# EasyEDA schematic SCH_Line-Follower-Circuit_2025-12-18.json
TITLE: Sheet_1; REV: 1.0; Date: 2025-11-16; Sheet: 1/1; Drawn By: Bhanusivaprakash; Company: Your Company
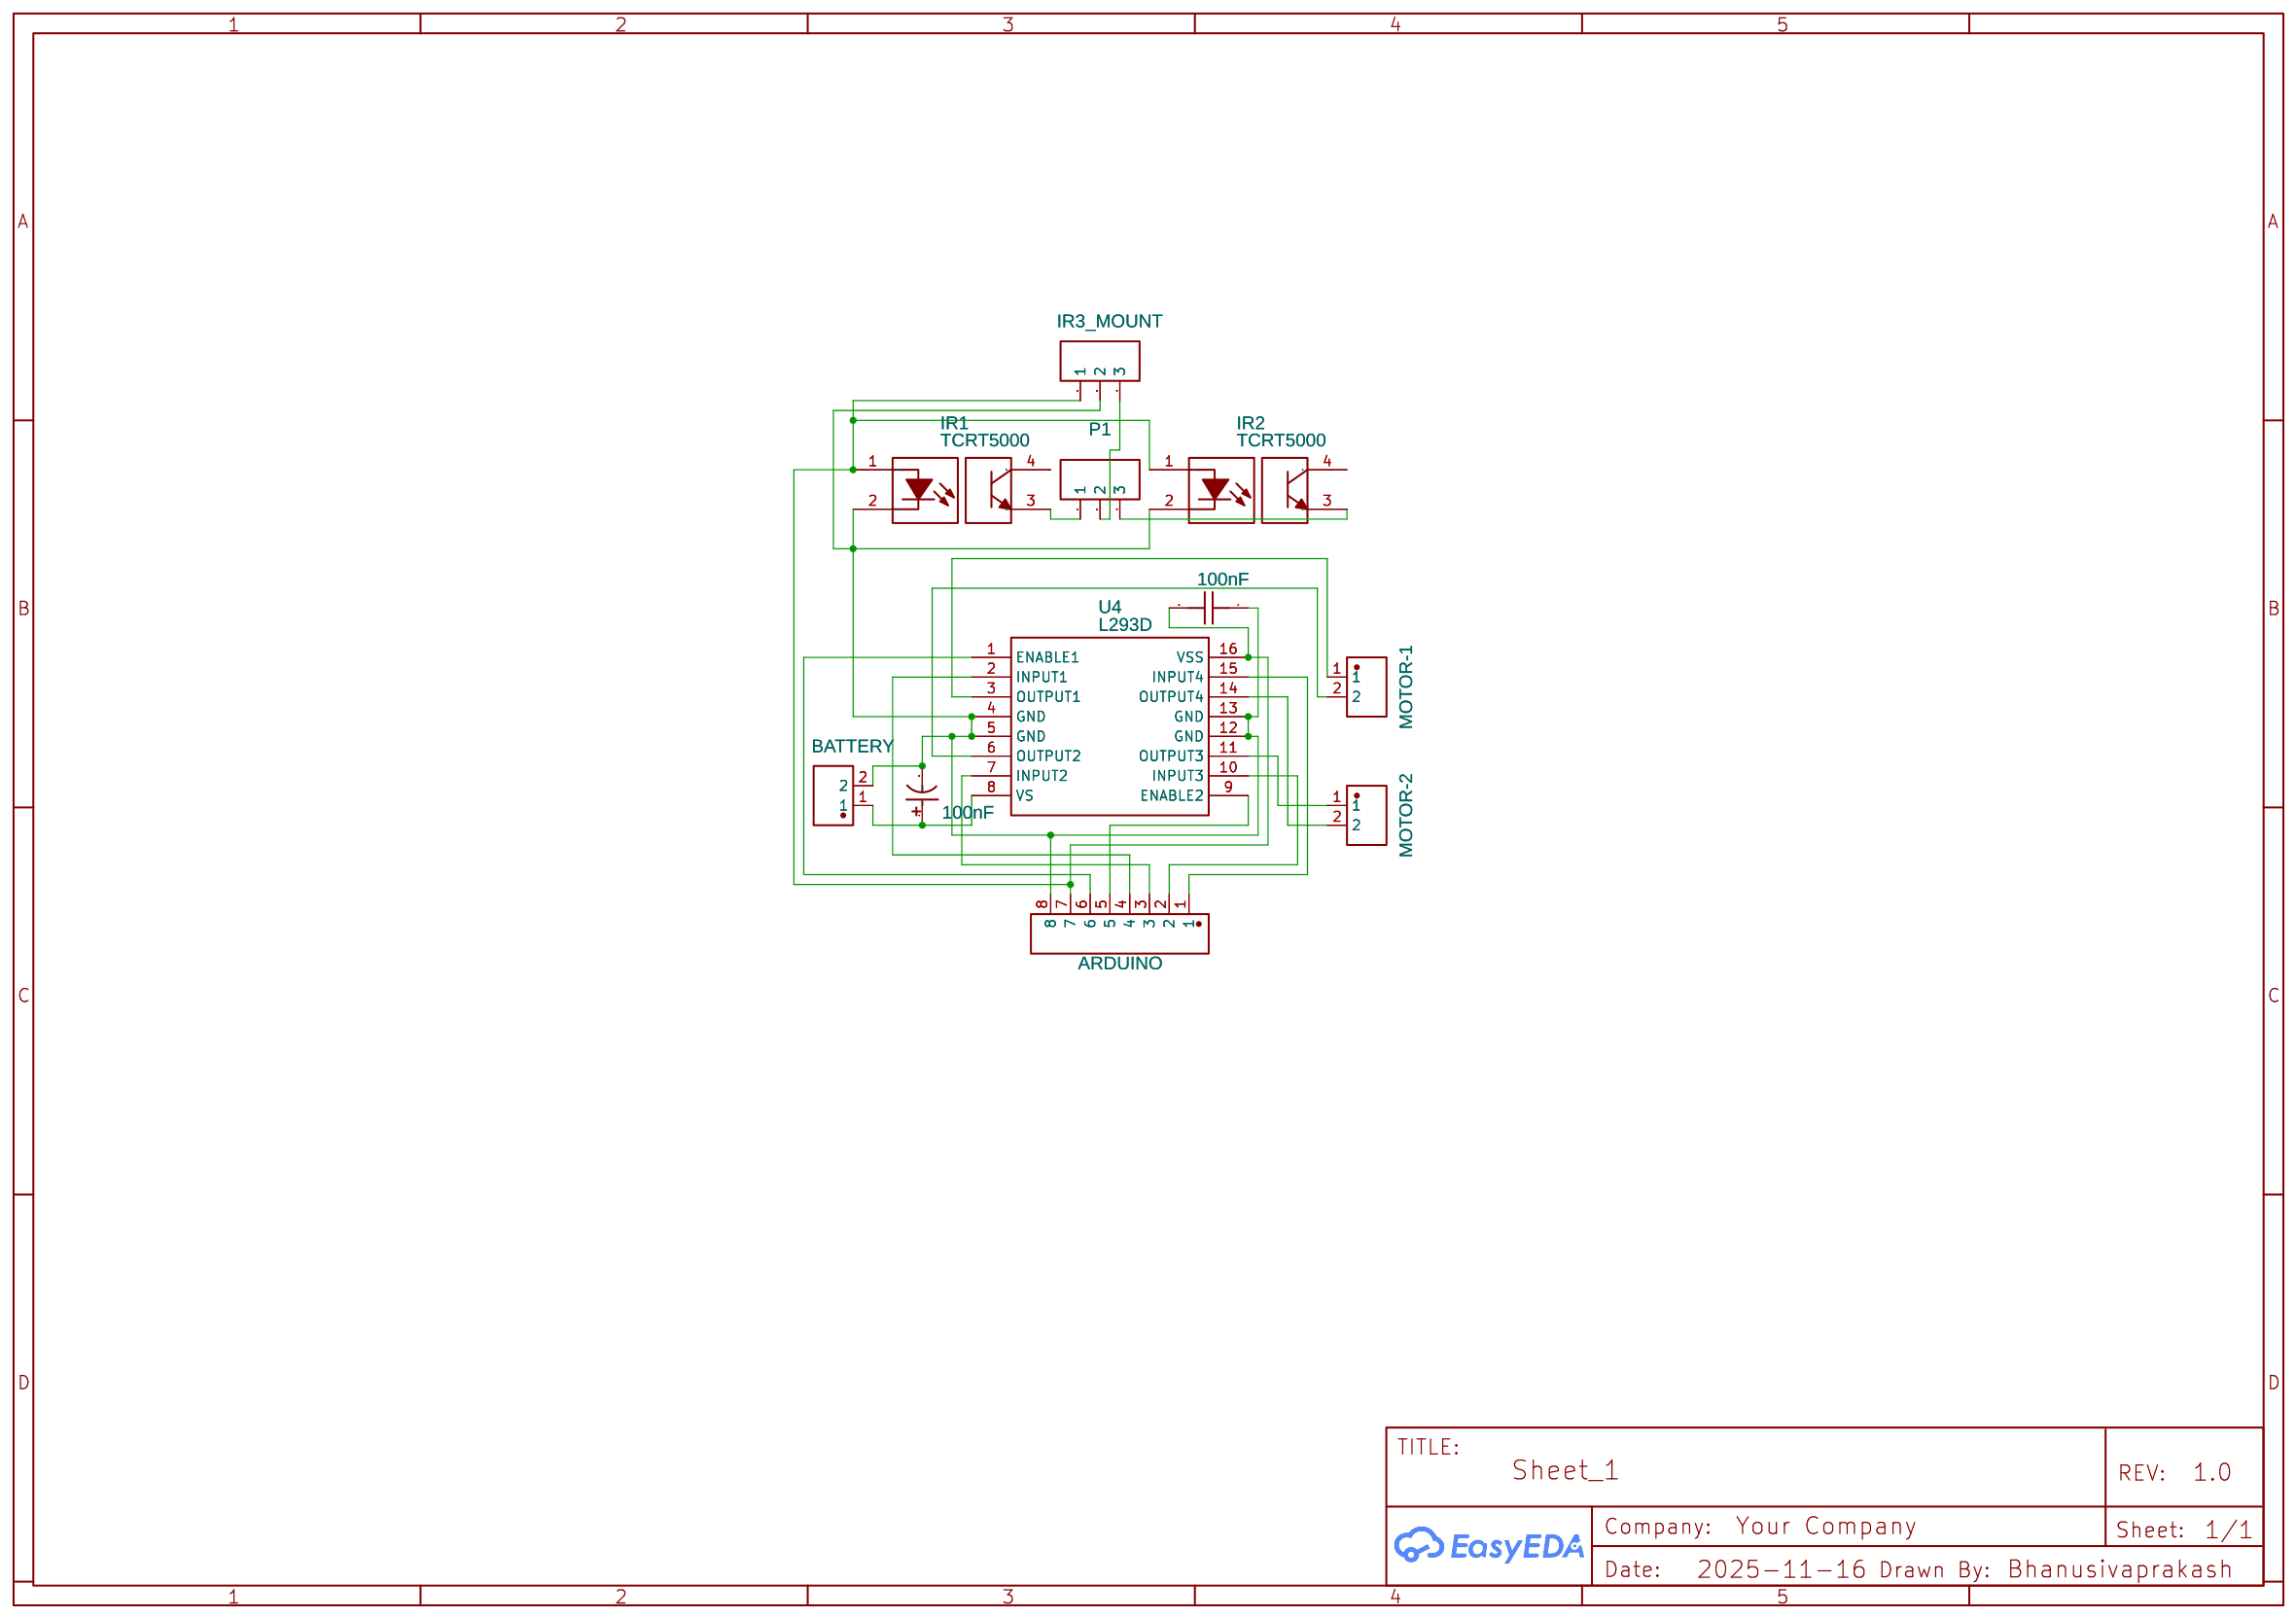
[diagram p0: schematic sheet]

## Parts
ARDUINO  X6511FV-08-C85D32  [HDR-TH_8P-P2.54-V-F]
BATTERY  KF301-5.0-2P  [CONN-TH_P5.00_KF301-5.0-2P]
C1  100nF  [CAP-TH_BD5.0-P2.00-D0.8-FD]
IR1  TCRT5000  [OPTO-TH_TCRT5000]
IR2  TCRT5000  [OPTO-TH_TCRT5000]
IR3_MOUNT  Header-Female-2.54_1x3  [HDR-TH_3P-P2.54-V-F]
MOTOR-1  KF301-5.0-2P  [CONN-TH_P5.00_KF301-5.0-2P]
MOTOR-2  KF301-5.0-2P  [CONN-TH_P5.00_KF301-5.0-2P]
P1  Header-Female-2.54_1x3  [HDR-TH_3P-P2.54-V-F]
U4  L293D  [DIP-16_L20.0-W6.4-P2.54-LS7.6-BL]
U5  100nF  [C0402]

## Library data of the parts
ARDUINO = X6511FV-08-C85D32: Contributor: LCSC; Supplier: LCSC; Supplier Part: C718237; Manufacturer: XKB Connection(中国星坤); JLCPCB Part Class: Extended Part
BATTERY MOTOR-1 MOTOR-2 = KF301-5.0-2P: Contributor: LCSC; Supplier: LCSC; Supplier Part: C474881; Manufacturer: KEFA(科发); JLCPCB Part Class: Extended Part
C1 = 47uF 16V Aluminum electrolytic capacitors: Supplier: LCSC; Manufacturer: Chengx(承兴); Manufacturer Part: KM476M016D11RR0VH2FP0; Supplier Part: C22320; JLCPCB Part Class: Extended Part
IR1 IR2 = TCRT5000: Contributor: lcsc; Supplier: LCSC; Supplier Part: C2984661; Manufacturer: VISHAY(威世); JLCPCB Part Class: Extended Part
IR3_MOUNT P1 = Header-Female-2.54_1x3: Supplier Part: C146243; Supplier: LCSC; Manufacturer: BOOMELE(博穆精密); Manufacturer Part: 2.54-1*3P母; JLCPCB Part Class: Extended Part
U4 = L293D: Contributor: pitreluc; Supplier: LCSC; Manufacturer: ST(意法半导体); Supplier Part: C12340; JLCPCB Part Class: Extended Part
U5 = GRM155R71E103KA01D | SMD CERAMIC CAPACITOR: Supplier: LCSC; Supplier Part: C29020409; Manufacturer: null; Manufacturer Part: GRM155R71E103KA01D | SMD Ceramic Capacitor; Contributor: lcsc

## Nets
Net-(ARDUINO-1): ARDUINO.1 U4.15(INPUT4)
Net-(ARDUINO-2): ARDUINO.2 U4.10(INPUT3)
Net-(ARDUINO-3): ARDUINO.3 U4.7(INPUT2)
Net-(ARDUINO-4): ARDUINO.4 U4.2(INPUT1)
Net-(ARDUINO-5): ARDUINO.5 U4.9(ENABLE2)
Net-(ARDUINO-6): ARDUINO.6 U4.1(ENABLE1)
Net-(ARDUINO-7): ARDUINO.7 IR1.1 IR2.1 IR3_MOUNT.1 U4.16(VSS) U5.2
Net-(ARDUINO-8): ARDUINO.8 BATTERY.2 C1.2 IR1.2 IR2.2 IR3_MOUNT.2 U4.4(GND) U4.5(GND) U4.12(GND) U4.13(GND) U5.1
Net-(BATTERY-1): BATTERY.1 C1.1 U4.8(VS)
Net-(IR1-3): IR1.3 P1.1
Net-(IR2-3): IR2.3 P1.3
Net-(IR3_MOUNT-3): IR3_MOUNT.3 P1.2
Net-(MOTOR-1-1): MOTOR-1.1 U4.3(OUTPUT1)
Net-(MOTOR-1-2): MOTOR-1.2 U4.6(OUTPUT2)
Net-(MOTOR-2-1): MOTOR-2.1 U4.11(OUTPUT3)
Net-(MOTOR-2-2): MOTOR-2.2 U4.14(OUTPUT4)

Not connected (* = marked no-connect by the designer): IR1 4; IR2 4
